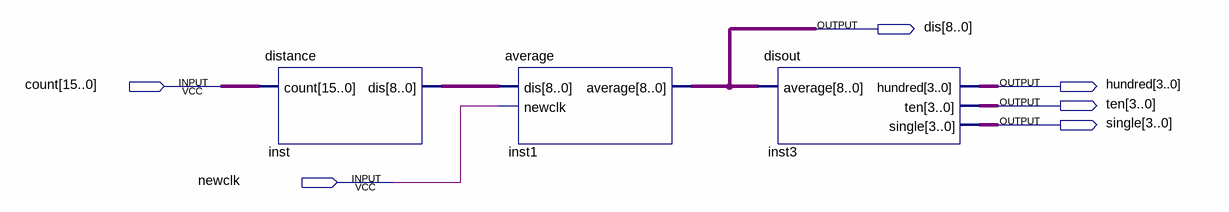
[diagram p0: schematic sheet]
// Quartus schematic final_distance.bdf as structural Verilog: 3 symbols, 6 pins
module final_distance (
  input  [15:0] count,
  input  newclk,
  output [8:0] dis,
  output [3:0] hundred,
  output [3:0] ten,
  output [3:0] single
);

  wire [8:0] inst_dis;

  distance inst (.count(count), .dis(inst_dis));
  average inst1 (.dis(inst_dis), .newclk(newclk), .average(dis));
  disout inst3 (.average(dis), .hundred(hundred), .ten(ten), .single(single));
endmodule
